# EasyEDA Pro project ADC.eprj

# Schematic Schematic1
Create Date: 2023-12-13; Page Name: P1; Project Name: ADC; Schematic Name: Schematic1; Update Date: 2024-01-19; Company: 嘉立创EDA; Page Size: A4; Version: V1.0
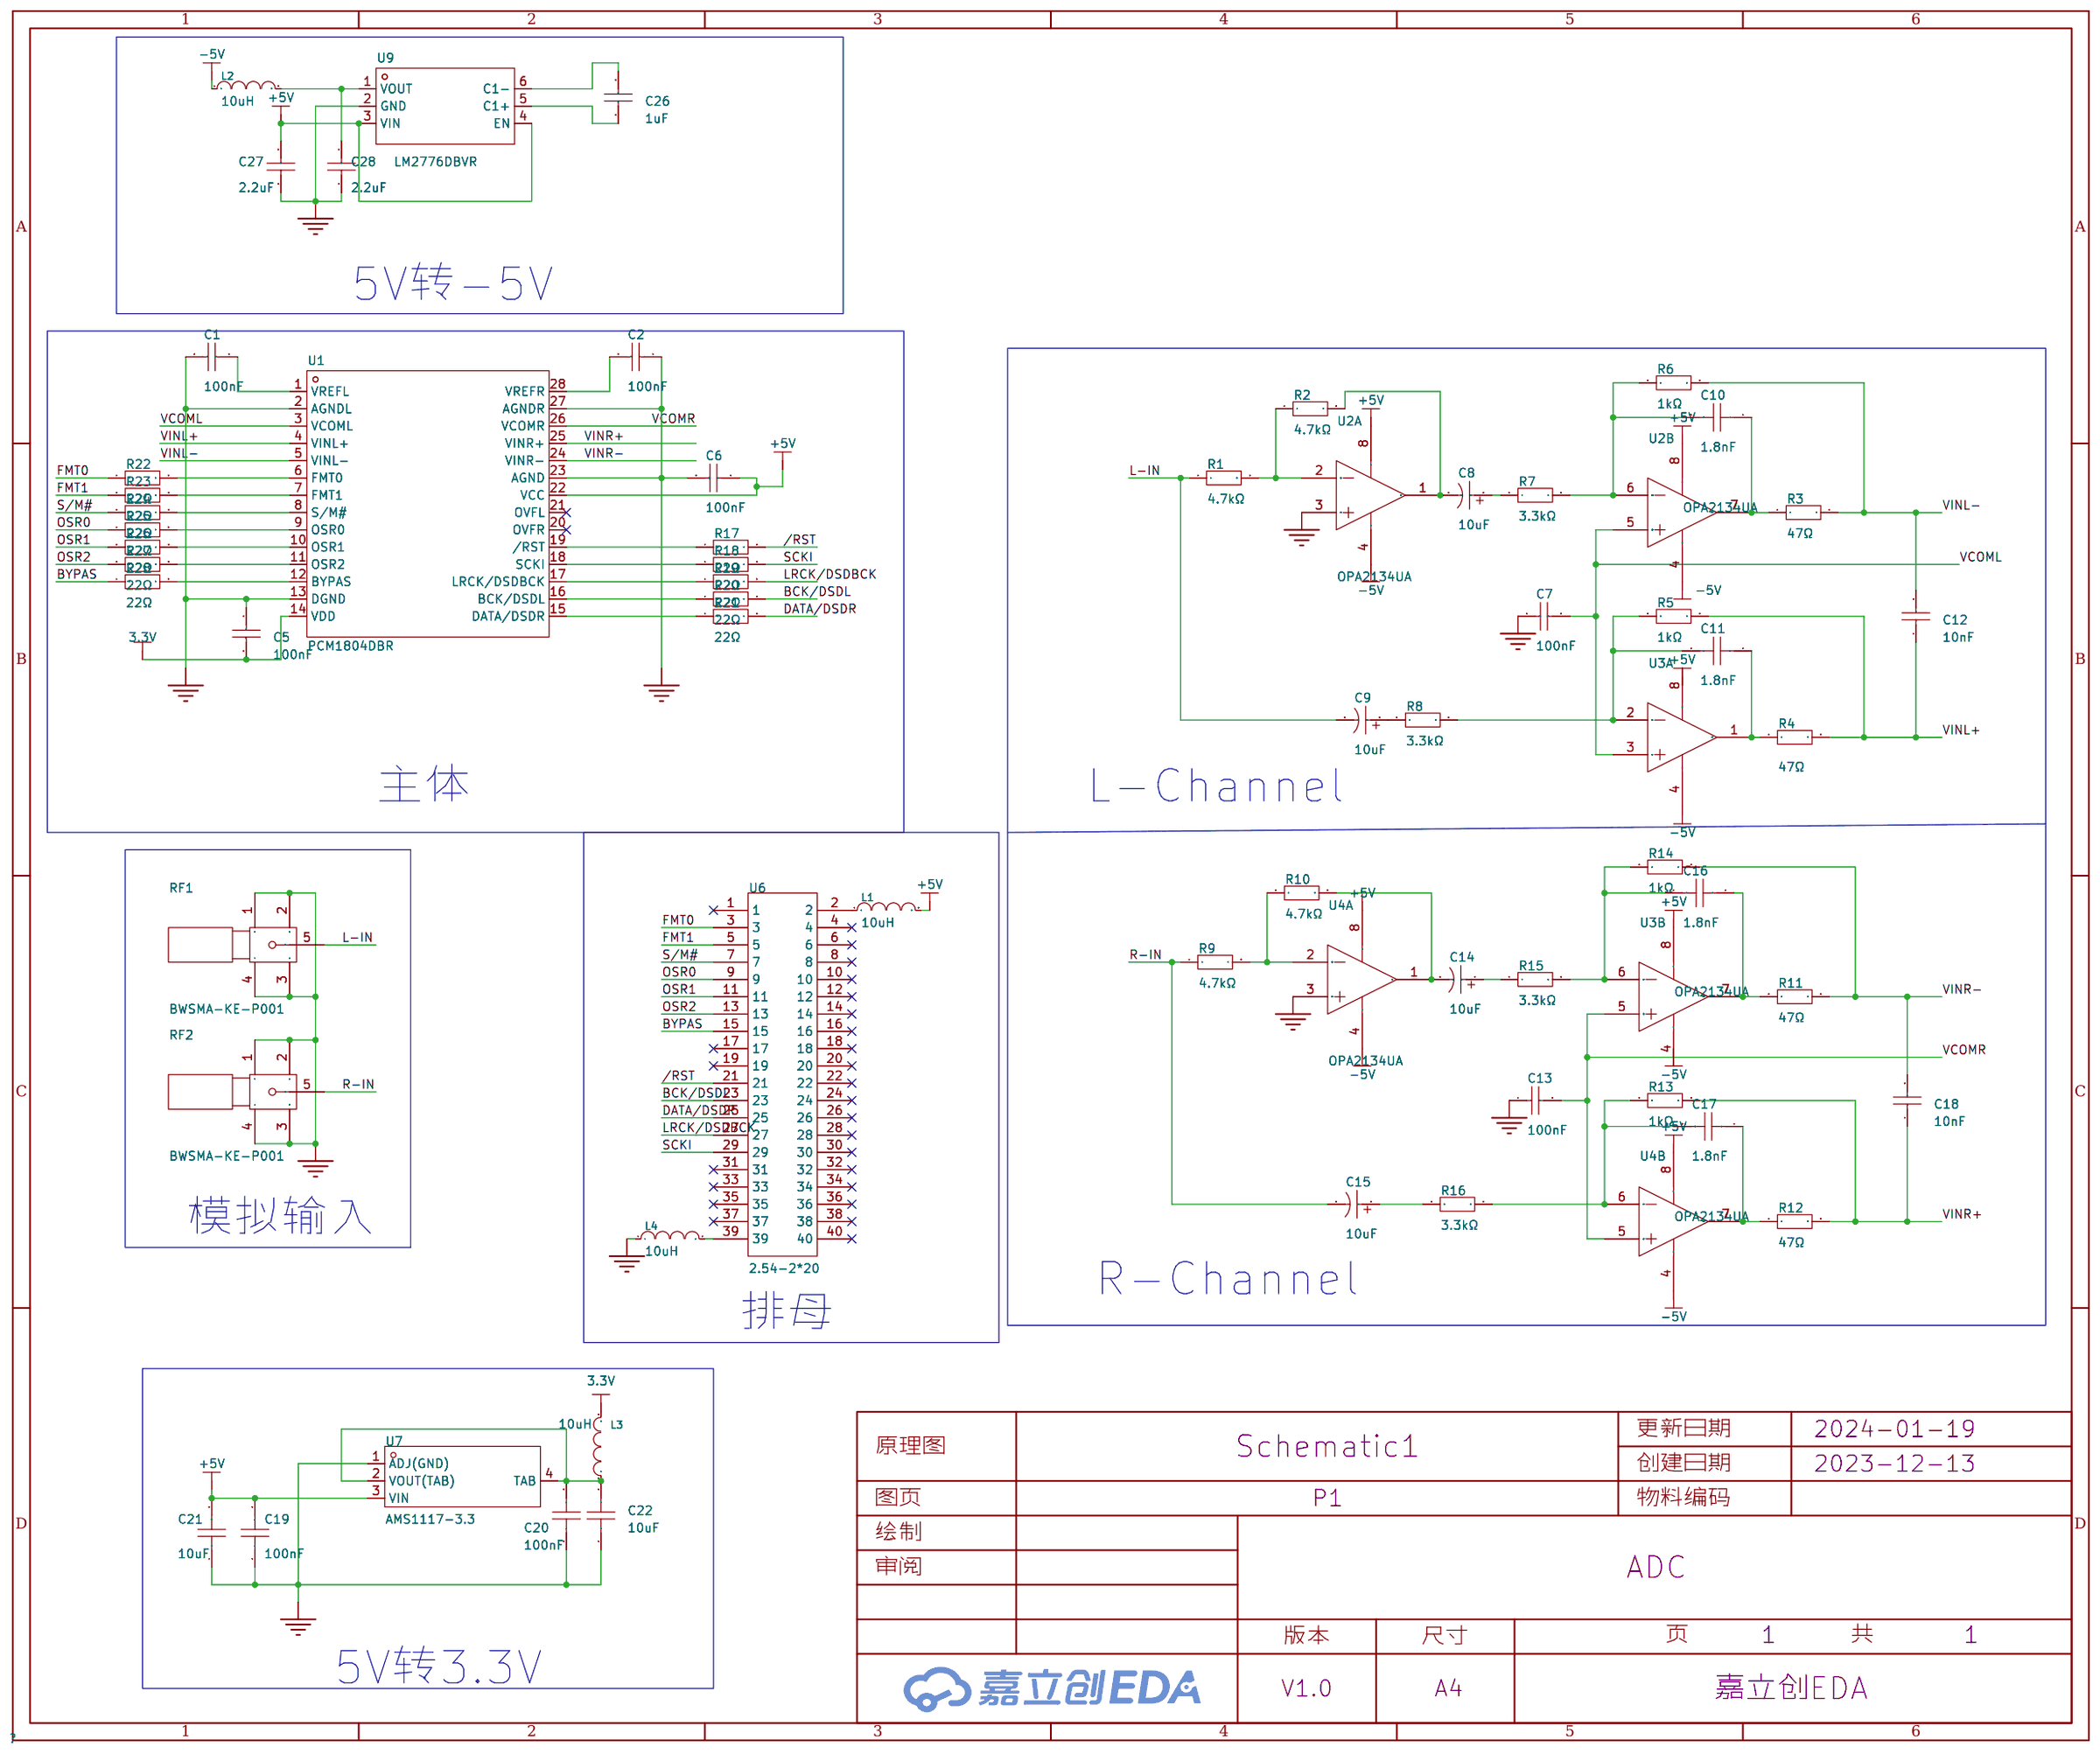
[diagram p0: schematic sheet]

## Parts
C1  100nF  [C0805]
C2  100nF  [C0805]
C5  100nF  [C0805]
C6  100nF  [C0805]
C7  100nF  [C0805]
C8  10uF  [CAP-SMD_BD6.3-L6.6-W6.6-FD]
C9  10uF  [CAP-SMD_BD6.3-L6.6-W6.6-FD]
C10  1.8nF  [C0805]
C11  1.8nF  [C0805]
C12  10nF  [C0805]
C13  100nF  [C0805]
C14  10uF  [CAP-SMD_BD6.3-L6.6-W6.6-FD]
C15  10uF  [CAP-SMD_BD6.3-L6.6-W6.6-FD]
C16  1.8nF  [C0805]
C17  1.8nF  [C0805]
C18  10nF  [C0805]
C19  100nF  [C0805]
C20  100nF  [C0805]
C21  10uF  [C0805]
C22  10uF  [C0805]
C26  1uF  [C0805]
C27  2.2uF  [C0805]
C28  2.2uF  [C0805]
L1  10uH  [L0805]
L2  10uH  [L0805]
L3  10uH  [L0805]
L4  10uH  [L0805]
R1  4.7kΩ  [R0805]
R2  4.7kΩ  [R0805]
R3  47Ω  [R0805]
R4  47Ω  [R0805]
R5  1kΩ  [R0805]
R6  1kΩ  [R0805]
R7  3.3kΩ  [R0805]
R8  3.3kΩ  [R0805]
R9  4.7kΩ  [R0805]
R10  4.7kΩ  [R0805]
R11  47Ω  [R0805]
R12  47Ω  [R0805]
R13  1kΩ  [R0805]
R14  1kΩ  [R0805]
R15  3.3kΩ  [R0805]
R16  3.3kΩ  [R0805]
R17  22Ω  [R0805]
R18  22Ω  [R0805]
R19  22Ω  [R0805]
R20  22Ω  [R0805]
R21  22Ω  [R0805]
R22  22Ω  [R0805]
R23  22Ω  [R0805]
R24  22Ω  [R0805]
R25  22Ω  [R0805]
R26  22Ω  [R0805]
R27  22Ω  [R0805]
R28  22Ω  [R0805]
RF1  BWSMA-KE-P001  [SMA-SMD_BWSMA-KE-P001]
RF2  BWSMA-KE-P001  [SMA-SMD_BWSMA-KE-P001]
U1  PCM1804DBR  [SSOP-28_L10.2-W5.3-P0.65-LS7.8-BL]
U2  OPA2134UA  [SOIC-8_L4.9-W3.9-P1.27-LS6.0-BL]  (sections 1,2)
U3  OPA2134UA  [SOIC-8_L4.9-W3.9-P1.27-LS6.0-BL]  (sections 1,2)
U4  OPA2134UA  [SOIC-8_L4.9-W3.9-P1.27-LS6.0-BL]  (sections 1,2)
U6  2.54-2*20  [HDR-TH_40P-P2.54-V-F-R2-C20-S2.54]
U7  AMS1117-3.3  [SOT-223-4_L6.5-W3.5-P2.30-LS7.0-BR]
U9  LM2776DBVR  [SOT-23-6_L2.9-W1.6-P0.95-LS2.8-BR]

## Library data of the parts
C1 C2 C5-C7 C13 C19 C20 = CC0805KRX7R9BB104: 容值:100nF;精度:±10%;额定电压:50V;材质(温度系数):X7R;; LCSC Part Name: 100nF ±10% 50V; Supplier Part: C49678; Manufacturer: YAGEO(国巨); Supplier Footprint: 0805; JLCPCB Part Class: Basic Part; Datasheet: https://atta.szlcsc.com/upload/public/pdf/source/20180224/C181747_15194369449651363981.pdf; Supplier: LCSC; Tolerance: ±10%; Voltage Rated: 50V; Temperature Coefficient: X7R
C8 C9 C14 C15 = RVT2A100M0607_C72482: 容值:10uF;精度:±20%;额定电压:100V;纹波电流:38mA@120Hz;等效串联电阻:-;; LCSC Part Name: 10uF ±20% 100V; Supplier Part: C72482; Manufacturer: ROQANG(容强); Manufacturer Part: RVT2A100M0607; Supplier Footprint: SMD,D6.3xL7.7mm; JLCPCB Part Class: 扩展库; Datasheet: https://atta.szlcsc.com/upload/public/pdf/source/20170325/1490427950282.pdf; Supplier: LCSC; Tolerance: ±20%; Rated Voltage: 100V; Ripple Current: 38mA@120Hz; φD: 6.3mm; L: 7.7mm; Lifetime @ Temp: 2000hrs@105℃; Operating Temperature: -40℃~+105℃
C10 C11 C16 C17 = CC0805JRNPO9BN182: 容值:1.8nF;精度:±5%;额定电压:50V;材质(温度系数):NP0;; LCSC Part Name: 1.8nF ±5% 50V; Supplier Part: C541499; Manufacturer: YAGEO(国巨); Supplier Footprint: 0805; JLCPCB Part Class: Extended Part; Datasheet: https://atta.szlcsc.com/upload/public/pdf/source/20200615/C541499_C350122DC0EF514A427E90C64CBF9163.pdf; Supplier: LCSC; Tolerance: ±5%; Voltage Rated: 50V; Temperature Coefficient: NP0
C12 C18 = CL21B103KBANNNC: 容值:10nF;精度:±10%;额定电压:50V;材质(温度系数):X7R;; LCSC Part Name: 10nF ±10% 50V; Supplier Part: C1710; Manufacturer: SAMSUNG(三星); Supplier Footprint: 0805; JLCPCB Part Class: Basic Part; Datasheet: https://atta.szlcsc.com/upload/public/pdf/source/20160218/1457707763339.pdf; Supplier: LCSC; Tolerance: ±10%; Voltage Rated: 50V; Temperature Coefficient: X7R
C21 C22 = CL21A106KAYNNNE_C15850: 容值:10uF;精度:±10%;额定电压:25V;材质(温度系数):X5R;; LCSC Part Name: 10uF ±10% 25V; Supplier Part: C15850; Manufacturer: SAMSUNG(三星); Manufacturer Part: CL21A106KAYNNNE; Supplier Footprint: 0805; JLCPCB Part Class: Basic Part; Datasheet: https://atta.szlcsc.com/upload/public/pdf/source/20160103/1457707679302.pdf; Supplier: LCSC; Tolerance: ±10%; Voltage Rated: 25V; Temperature Coefficient: X5R
C26 = CL21B105KBFNNNE: 容值:1uF;精度:±10%;额定电压:50V;材质(温度系数):X7R;; LCSC Part Name: 1uF ±10% 50V; Supplier Part: C28323; Manufacturer: SAMSUNG(三星); Supplier Footprint: 0805; JLCPCB Part Class: Basic Part; Datasheet: https://atta.szlcsc.com/upload/public/pdf/source/20160218/1457707763339.pdf; Supplier: LCSC; Tolerance: ±10%; Voltage Rated: 50V; Temperature Coefficient: X7R
C27 C28 = CL21A225KBQNNNE: 容值:2.2uF;精度:±10%;额定电压:50V;材质(温度系数):X5R;; LCSC Part Name: 2.2uF ±10% 50V; Supplier Part: C377773; Manufacturer: SAMSUNG(三星); Supplier Footprint: 0805; JLCPCB Part Class: Extended Part; Datasheet: https://atta.szlcsc.com/upload/public/pdf/source/20190327/C377773_F663556E8B678C5EA7A210E6B154453B.pdf; Supplier: LCSC; Tolerance: ±10%; Voltage Rated: 50V; Temperature Coefficient: X5R
L1-L4 = SDFL2012S100KTF: 电感值:10uH;精度:±10%;额定电流:15mA;饱和电流(Isat):-;直流电阻(DCR):1.15Ω;; LCSC Part Name: 10uH ±10%; Supplier Part: C1046; Manufacturer: Sunlord(顺络); Supplier Footprint: 0805; JLCPCB Part Class: Basic Part; Datasheet: https://atta.szlcsc.com/upload/public/pdf/source/20210816/855F4348312D259031B87CBCF31BE802.pdf; Supplier: LCSC; Tolerance: ±10%; Rated Current: 15mA; DC Resistance (DCR): 1.15Ω
R1 R2 R9 R10 = 0805W8F4701T5E: 阻值:4.7kΩ;精度:±1%;功率:125mW;温度系数:±100ppm/℃;电阻类型:厚膜电阻;; LCSC Part Name: 4.7kΩ ±1% 125mW 厚膜电阻; Supplier Part: C17673; Manufacturer: UNI-ROYAL(厚声); Supplier Footprint: 0805; JLCPCB Part Class: Basic Part; Datasheet: https://atta.szlcsc.com/upload/public/pdf/source/20200306/C422600_1E6D84923E4A46A82E41ADD87F860B5C.pdf; Supplier: LCSC; Tolerance: ±1%; Power(Watts): 125mW; Overload Voltage (Max): 150V; Temperature Coefficient: ±100ppm/℃; Type: 厚膜电阻; Operating Temperature Range: -55℃~+155℃
R3 R4 R11 R12 = 0805W8F4702T5E: 阻值:47kΩ;精度:±1%;功率:125mW;温度系数:±100ppm/℃;电阻类型:厚膜电阻;; LCSC Part Name: 47kΩ ±1% 125mW 厚膜电阻; Supplier Part: C17713; Manufacturer: UNI-ROYAL(厚声); Supplier Footprint: 0805; JLCPCB Part Class: Basic Part; Datasheet: https://atta.szlcsc.com/upload/public/pdf/source/20200306/C422600_1E6D84923E4A46A82E41ADD87F860B5C.pdf; Supplier: LCSC; Tolerance: ±1%; Power(Watts): 125mW; Overload Voltage (Max): 150V; Temperature Coefficient: ±100ppm/℃; Type: 厚膜电阻; Operating Temperature Range: -55℃~+155℃
R5 R6 R13 R14 = 0805W8F1001T5E: 阻值:1kΩ;精度:±1%;功率:125mW;温度系数:±100ppm/℃;电阻类型:厚膜电阻;; LCSC Part Name: 1kΩ ±1% 125mW 厚膜电阻; Supplier Part: C17513; Manufacturer: UNI-ROYAL(厚声); Supplier Footprint: 0805; JLCPCB Part Class: Basic Part; Datasheet: https://atta.szlcsc.com/upload/public/pdf/source/20200306/C422600_1E6D84923E4A46A82E41ADD87F860B5C.pdf; Supplier: LCSC; Tolerance: ±1%; Power(Watts): 125mW; Overload Voltage (Max): 150V; Temperature Coefficient: ±100ppm/℃; Type: 厚膜电阻; Operating Temperature Range: -55℃~+155℃
R7 R8 R15 R16 = 0805W8F3301T5E: 阻值:3.3kΩ;精度:±1%;功率:125mW;温度系数:±100ppm/℃;电阻类型:厚膜电阻;; LCSC Part Name: 3.3kΩ ±1% 125mW 厚膜电阻; Supplier Part: C26010; Manufacturer: UNI-ROYAL(厚声); Supplier Footprint: 0805; JLCPCB Part Class: Basic Part; Datasheet: https://atta.szlcsc.com/upload/public/pdf/source/20200306/C422600_1E6D84923E4A46A82E41ADD87F860B5C.pdf; Supplier: LCSC; Tolerance: ±1%; Power(Watts): 125mW; Overload Voltage (Max): 150V; Temperature Coefficient: ±100ppm/℃; Type: 厚膜电阻; Operating Temperature Range: -55℃~+155℃
R17-R28 = 0805W8F220JT5E: 阻值:22Ω;精度:±1%;功率:125mW;温度系数:±100ppm/℃;电阻类型:厚膜电阻;; LCSC Part Name: 22Ω ±1% 125mW 厚膜电阻; Supplier Part: C17561; Manufacturer: UNI-ROYAL(厚声); Supplier Footprint: 0805; JLCPCB Part Class: 基础库; Datasheet: https://atta.szlcsc.com/upload/public/pdf/source/20200306/C422600_1E6D84923E4A46A82E41ADD87F860B5C.pdf; Supplier: LCSC; Tolerance: ±1%; Power(Watts): 125mW; Overload Voltage (Max): 150V; Temperature Coefficient: ±100ppm/℃; Type: 厚膜电阻; Operating Temperature Range: -55℃~+155℃
RF1 RF2 = BWSMA-KE-P001: 连接器类型:板端;接口类型:内孔;端口数量:1;接口直径:5.2mm;接口长度/高度:-;频率-最大值:-;射频系列:SMA;阻抗:50Ω;样式:偏脚;触头材质:-;触头镀层:-;工作温度范围:-;焊接温度(最大值):-;; LCSC Part Name: 内孔 SMA 偏脚 SMA偏脚板端座子; Supplier Part: C496550; Manufacturer: BAT WIRELESS(蝙蝠无线); Supplier Footprint: 插件; JLCPCB Part Class: Extended Part; Datasheet: https://atta.szlcsc.com/upload/public/pdf/source/20200416/C496550_06668BF2E3B968EA39F96D17E7156373.pdf; Supplier: LCSC; Connector Type: 板端; Interface Type: 内孔; Number of Ports: 1; Interface Diameter: 5.2mm; RF Series: SMA; Impedance: 50Ω; Style: 偏脚
U1 = PCM1804DBR: 供电电压:3V~3.6V；4.75V~5.25V;分辨率(位):24;接口类型:I2S;; Supplier Part: C62360; Manufacturer: TI(德州仪器); Supplier Footprint: SSOP-28-208mil; JLCPCB Part Class: 扩展库; Datasheet: https://www.ti.com/cn/lit/gpn/pcm1804; Supplier: LCSC; Supply Voltage: 3V~3.6V；4.75V~5.25V; Number of Channels: 2; Resolution: 24; Interface Type: I2S; Operating Temperature: -10℃~+70℃
U2-U4 = OPA2134UA: 功放类型:-;扬声器通道数:2通道;输出功率:-;; Supplier Part: C2860321; Manufacturer: TI(德州仪器); Supplier Footprint: SOIC-8; JLCPCB Part Class: Extended Part; Datasheet: https://atta.szlcsc.com/upload/public/pdf/source/20230221/04F5AACAA47A202A62C17BFD20F1D2D5.pdf; Supplier: LCSC; Speaker Channels: 2通道; Operating Temperature: -40℃~+85℃
U6 = 2.54-2*20: 排数:双排;总孔位数:40P;间距:2.54mm;插孔结构:2x20P;行距:2.54mm;安装类型:直插;圆孔/方孔:方孔;额定电流:2.5A;额定电压:-;插孔方向:顶部;塑高:8.5mm;工作温度范围:-40℃~+105℃;; LCSC Part Name: 间距:2.54mm 2x20P 直插 镀金环保阻燃UL认证; Supplier Part: C2977589; Manufacturer: ZHOURI(洲日); Supplier Footprint: 插件,P=2.54mm; JLCPCB Part Class: 扩展库; Datasheet: https://atta.szlcsc.com/upload/public/pdf/source/20220328/834E302BE3C038BBC5C70F5E02589B1E.pdf; Supplier: LCSC; Number of Rows: 双排; Number of Holes: 40P; Pitch: 2.54mm; Holes Structure: 2x20P; Row Spacing: 2.54mm; Mounting Type: 直插; Circular Hole / Square Hole: 方孔; Current Rating (Max): 2.5A; Holes Direction: 顶部; Insulation Height: 8.5mm; Operating Temperature Range: -40℃~+105℃
U7 = AMS1117-3.3_C347222: 输出类型:固定;最大输入电压:18V;输出电压:3.3V;输出电流:1A;电源纹波抑制比(PSRR):60dB@(120Hz);输出极性:正;; LCSC Part Name: 输入18V 输出3.3V 1A; Supplier Part: C347222; Manufacturer: UMW(友台半导体); Supplier Footprint: SOT-223; JLCPCB Part Class: 扩展库; Datasheet: https://atta.szlcsc.com/upload/public/pdf/source/20231109/155D79A26D9DB04352555A58D5969DC8.pdf; Supplier: LCSC; Output Type: 固定; Maximum Input Voltage: 18V; Output Voltage: 3.3V; Output Current: 1A; Power Supply Rejection Ratio (PSRR): 60dB@(120Hz); Dropout Voltage: 1.3V@(1A); Output Polarity: 正; Number of Outputs: 1
U9 = LM2776DBVR: 功能类型:电荷泵;输出类型:固定;输入电压:2.7V~5.5V;输出电压:-5.5V~-2.7V;输出电流(最大值):200mA;; Supplier Part: C69527; Manufacturer: TI(德州仪器); Supplier Footprint: SOT-23-6; JLCPCB Part Class: 扩展库; Datasheet: https://www.ti.com/cn/lit/gpn/lm2776; Supplier: LCSC; Function: 电荷泵; Synchronous Rectification: 否; Output Type: 固定; Number of Outputs: 1; Input Voltage: 2.7V~5.5V; Output Voltage: -5.5V~-2.7V; Output Current (Max): 200mA; Switching Frequency: 2MHz; Operating Temperature: -40℃~+85℃@(TA)

## Nets
3.3V: C5.2 L3.2 U1.14(VDD)
+5V: C6.1 C19.2 C21.2 C27.2 L1.2 U1.22(VCC) U2.8(V+) U3.8(V+) U4.8(V+) U7.3(VIN) U9.3(VIN) U9.4(EN)
-5V: L2.1 U2.4(V-) U3.4(V-) U4.4(V-)
GND: C1.2 C2.1 C5.1 C6.2 C7.1 C13.1 C19.1 C20.1 C21.1 C22.1 C27.1 C28.1 L4.1 RF1.1 RF1.2 RF1.3 RF1.4 RF2.1 RF2.2 RF2.3 RF2.4 U1.2(AGNDL) U1.13(DGND) U1.23(AGND) U1.27(AGNDR) U2.3(+IN A) U4.3(+IN A) U7.1(ADJ(GND)) U9.2(GND)
VINL+: C12.1 R4.2 R5.2 U1.4(VINL+)
VINL-: C12.2 R3.2 R6.2 U1.5(VINL-)
VINR+: C18.1 R12.2 R13.2 U1.25(VINR+)
VINR-: C18.2 R11.2 R14.2 U1.24(VINR-)
/RST: R17.2 U6.21
BCK/DSDL: R20.2 U6.23
BYPAS: R28.1 U6.15
DATA/DSDR: R21.2 U6.25
FMT0: R22.1 U6.3
FMT1: R23.1 U6.5
L-IN: C9.2 R1.1 RF1.5
LRCK/DSDBCK: R19.2 U6.27
OSR0: R25.1 U6.9
OSR1: R26.1 U6.11
OSR2: R27.1 U6.13
R-IN: C15.2 R9.1 RF2.5
S/M#: R24.1 U6.7
SCKI: R18.2 U6.29
VCOML: C7.2 U1.3(VCOML) U2.5(+IN B) U3.3(+IN A)
VCOMR: C13.2 U1.26(VCOMR) U3.5(+IN B) U4.5(+IN B)
$1N963: R22.2 U1.6(FMT0)
$1N966: R23.2 U1.7(FMT1)
$1N969: R24.2 U1.8(S/M#)
$1N972: R25.2 U1.9(OSR0)
$1N975: R26.2 U1.10(OSR1)
$1N978: R27.2 U1.11(OSR2)
$1N981: R28.2 U1.12(BYPAS)
$1N984: R21.1 U1.15(DATA/DSDR)
$1N987: R20.1 U1.16(BCK/DSDL)
$1N990: R19.1 U1.17(LRCK/DSDBCK)
$1N993: R18.1 U1.18(SCKI)
$1N996: R17.1 U1.19(/RST)
$1N1209: C1.1 U1.1(VREFL)
$1N1256: C2.2 U1.28(VREFR)
$1N1970: R1.2 R2.1 U2.2(-IN A)
$1N1981: C8.2 R2.2 U2.1(OUT A)
$1N3561: C8.1 R7.1
$1N3720: C9.1 R8.1
$1N3842: C10.2 R6.1 R7.2 U2.6(-IN B)
$1N3853: C10.1 R3.1 U2.7(OUT B)
$1N3857: C11.1 R4.1 U3.1(OUT A)
$1N3861: C11.2 R5.1 R8.2 U3.2(-IN A)
$1N4676: R9.2 R10.1 U4.2(-IN A)
$1N4677: C14.2 R10.2 U4.1(OUT A)
$1N4681: C14.1 R15.1
$1N4683: C15.1 R16.1
$1N4688: C16.2 R14.1 R15.2 U3.6(-IN B)
$1N4694: C16.1 R11.1 U3.7(OUT B)
$1N4697: C17.1 R12.1 U4.7(OUT B)
$1N4700: C17.2 R13.1 R16.2 U4.6(-IN B)
$1N6196: C20.2 C22.2 L3.1 U7.2(VOUT(TAB)) U7.4(TAB)
$1N15402: L1.1 U6.2
$1N31086: C26.2 U9.6(C1-)
$1N31091: C26.1 U9.5(C1+)
$1N34155: C28.2 L2.2 U9.1(VOUT)
$1N35743: L4.2 U6.39

Not connected (* = marked no-connect by the designer): U1 20(OVFR)* 21(OVFL)*; U6 1* 4* 6* 8* 10* 12* 14* 16* 17* 18* 19* 20* 22* 24* 26* 28* 30* 31* 32* 33* 34* 35* 36* 37* 38* 40*

## Notes on the sheet
- 5V转-5V
- 主体
- L-Channel
- 模拟输入
- R-Channel
- 排母
- 5V转3.3V

# Board PCB1
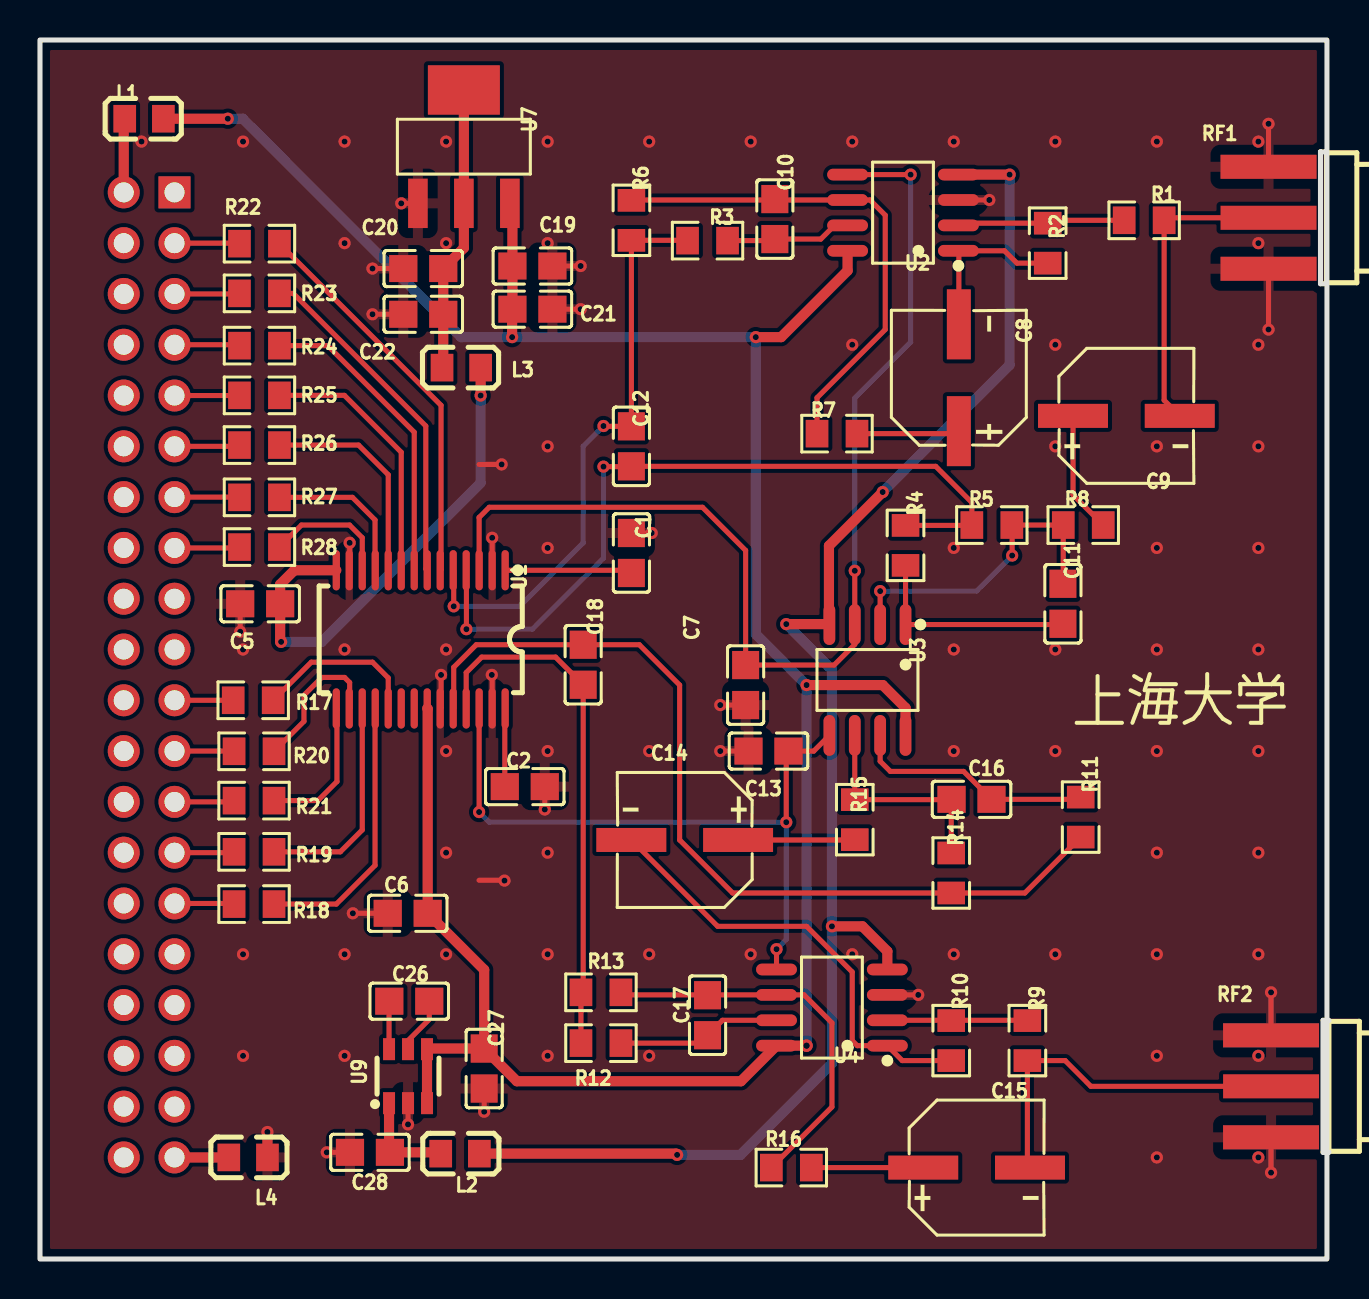
[diagram p1: board, top side]
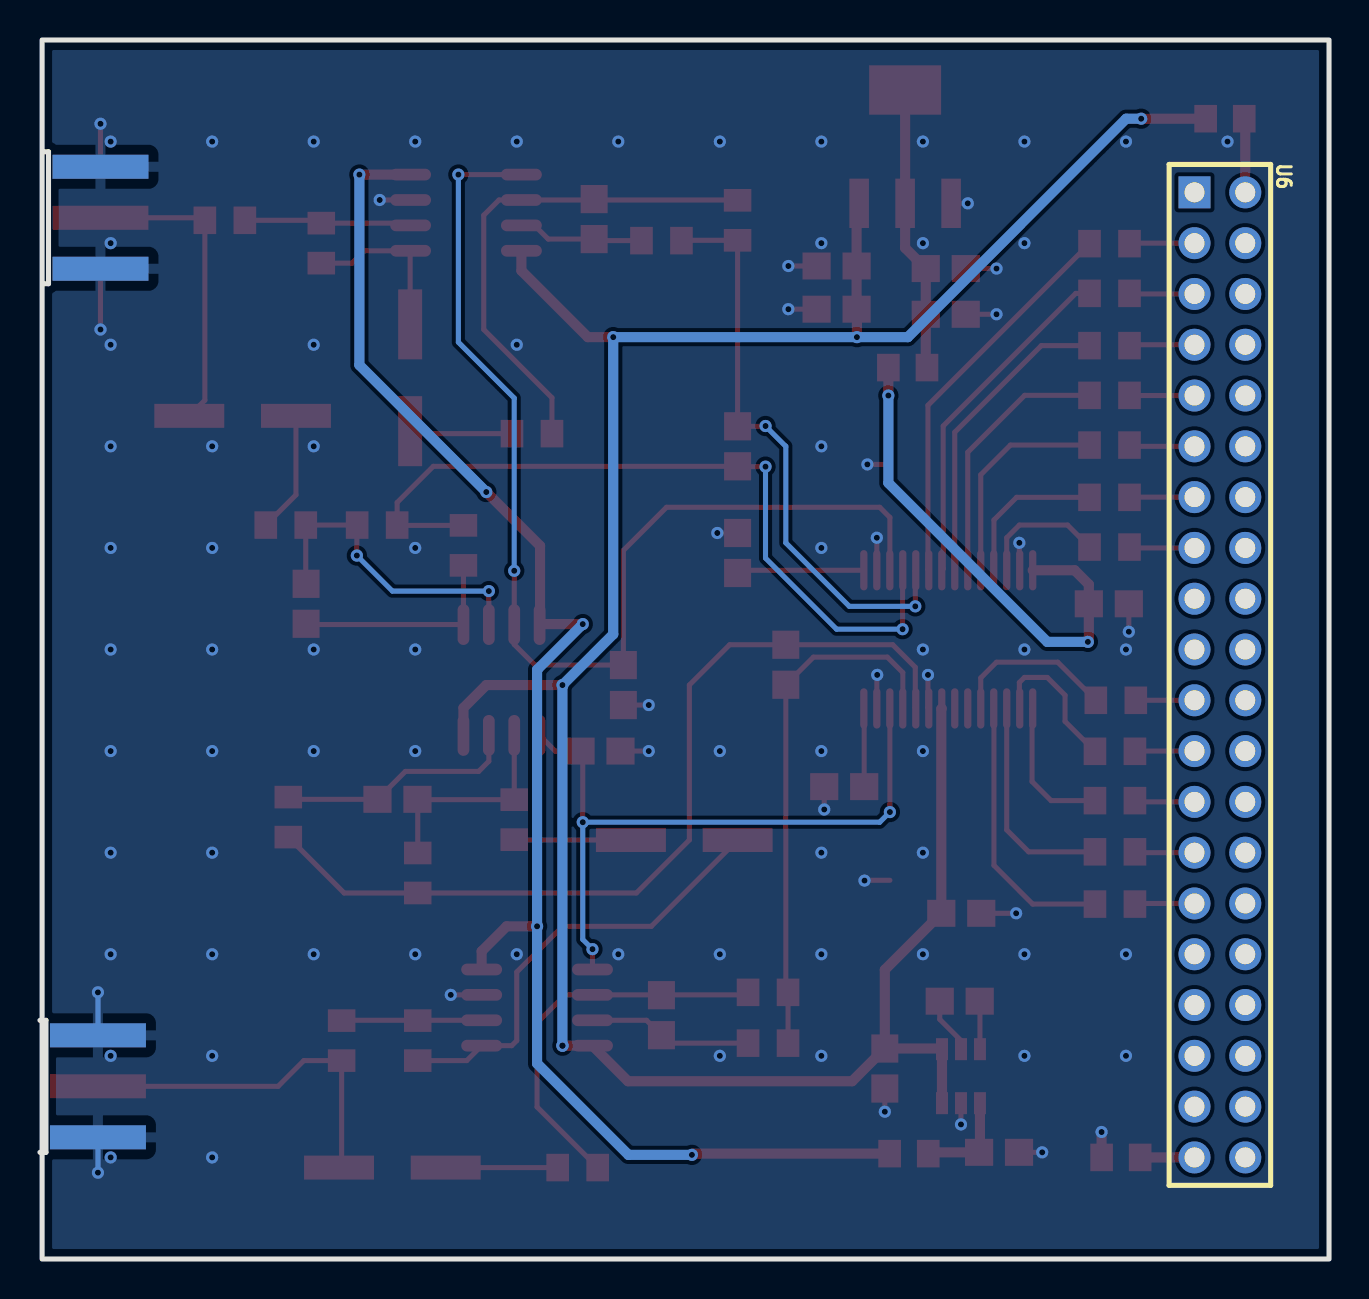
[diagram p2: board, bottom side, seen from below]

Outline 64.5 x 60.96 mm; copper layers: Top Layer, Bottom Layer. Coordinates in mm from the lower left corner of the outline.
Outline path: rectangle 0,60.96 64.39,0
Stack: Top Layer 0.035mm - / Dielectric1 1.51mm FR4 er 4.5 / Bottom Layer 0.035mm -

## Design rules (mm)
template: 自定义配置
spacing copperThickness1oz (default): track to track 0.102, other pairs 0.102 to 0.3
spacing copperThickness2oz: track to track 0.203, other pairs 0.152 to 0.3
track width copperThickness1oz (default): min 0.127, default 0.254, max 2.54
track width copperThickness2oz: min 0.203, default 0.254, max 2.54
differential pair differentialPair (default): width min 0.127, default 0.254, max 2.54; gap min 0.152, default 0.152
via viaSize (default): diameter min 0.5, default 0.61, max 10; hole min 0.3, default 0.305, max 6.299

## Placement (name value [footprint] x y rotation side)
C1  100nF  [C0805]  29.59 35.31 90 top
C2  100nF  [C0805]  24.26 23.62 180 top
C5  100nF  [C0805]  11.02 32.77 0 top
C6  100nF  [C0805]  18.4 17.29 180 top
C7  100nF  [C0805]  35.31 28.7 90 top
C8  10uF  [CAP-SMD_BD6.3-L6.6-W6.6-FD]  45.97 44.07 90 top
C9  10uF  [CAP-SMD_BD6.3-L6.6-W6.6-FD]  54.36 42.16 0 top
C10  1.8nF  [C0805]  36.77 52.01 90 top
C11  1.8nF  [C0805]  51.18 32.77 90 top
C12  10nF  [C0805]  29.59 40.64 90 top
C13  100nF  [C0805]  36.45 25.4 0 top
C14  10uF  [CAP-SMD_BD6.3-L6.6-W6.6-FD]  32.26 20.96 180 top
C15  10uF  [CAP-SMD_BD6.3-L6.6-W6.6-FD]  46.86 4.57 0 top
C16  1.8nF  [C0805]  46.61 22.99 180 top
C17  1.8nF  [C0805]  33.4 12.19 90 top
C18  10nF  [C0805]  27.18 29.72 90 top
C19  100nF  [C0805]  24.64 49.66 180 top
C20  100nF  [C0805]  19.18 49.53 0 top
C21  10uF  [C0805]  24.64 47.5 180 top
C22  10uF  [C0805]  19.18 47.24 0 top
C26  1uF  [C0805]  18.48 12.89 180 top
C27  2.2uF  [C0805]  22.23 9.53 90 top
C28  2.2uF  [C0805]  16.51 5.33 0 top
L1  10uH  [L0805]  5.21 57.02 0 top
L2  10uH  [L0805]  21.02 5.27 180 top
L3  10uH  [L0805]  21.08 44.58 0 top
L4  10uH  [L0805]  10.41 5.08 180 top
R1  4.7kΩ  [R0805]  55.25 51.94 180 top
R2  4.7kΩ  [R0805]  50.42 50.8 270 top
R3  47Ω  [R0805]  33.4 50.93 180 top
R4  47Ω  [R0805]  43.31 35.69 90 top
R5  1kΩ  [R0805]  47.63 36.7 180 top
R6  1kΩ  [R0805]  29.59 51.94 270 top
R7  3.3kΩ  [R0805]  39.88 41.28 180 top
R8  3.3kΩ  [R0805]  52.2 36.7 180 top
R9  4.7kΩ  [R0805]  49.4 10.92 90 top
R10  4.7kΩ  [R0805]  45.59 10.92 270 top
R11  47Ω  [R0805]  52.07 22.1 270 top
R12  47Ω  [R0805]  28.07 10.8 180 top
R13  1kΩ  [R0805]  28.07 13.34 180 top
R14  1kΩ  [R0805]  45.59 19.3 270 top
R15  3.3kΩ  [R0805]  40.77 21.97 90 top
R16  3.3kΩ  [R0805]  37.59 4.57 180 top
R17  22Ω  [R0805]  10.67 27.94 180 top
R18  22Ω  [R0805]  10.71 17.75 180 top
R19  22Ω  [R0805]  10.71 20.36 180 top
R20  22Ω  [R0805]  10.71 25.39 180 top
R21  22Ω  [R0805]  10.71 22.92 180 top
R22  22Ω  [R0805]  10.98 50.78 0 top
R23  22Ω  [R0805]  10.98 48.29 0 top
R24  22Ω  [R0805]  10.98 45.68 0 top
R25  22Ω  [R0805]  10.98 43.19 0 top
R26  22Ω  [R0805]  10.98 40.7 0 top
R27  22Ω  [R0805]  10.98 38.09 0 top
R28  22Ω  [R0805]  10.98 35.6 0 top
RF1  BWSMA-KE-P001  [SMA-SMD_BWSMA-KE-P001]  61.47 52.07 0 top
RF2  BWSMA-KE-P001  [SMA-SMD_BWSMA-KE-P001]  61.6 8.64 0 top
U1  PCM1804DBR  [SSOP-28_L10.2-W5.3-P0.65-LS7.8-BL]  19.05 30.99 180 top
U2  OPA2134UA  [SOIC-8_L4.9-W3.9-P1.27-LS6.0-BL]  43.18 52.32 90 top
U3  OPA2134UA  [SOIC-8_L4.9-W3.9-P1.27-LS6.0-BL]  41.4 28.96 180 top
U4  OPA2134UA  [SOIC-8_L4.9-W3.9-P1.27-LS6.0-BL]  39.62 12.57 90 top
U6  2.54-2*20  [HDR-TH_40P-P2.54-V-F-R2-C20-S2.54]  5.46 29.21 270 bottom
U7  AMS1117-3.3  [SOT-223-4_L6.5-W3.5-P2.30-LS7.0-BR]  21.21 55.63 270 top
U9  LM2776DBVR  [SOT-23-6_L2.9-W1.6-P0.95-LS2.8-BR]  18.42 9.14 270 top

## Footprints (pads in the part's own frame, mm; a bottom-side part is the same pattern mirrored in y, then rotated)
C0805
  rect 1.41x1.35 smd: 1(-1,0) 2(1,0)
CAP-SMD_BD6.3-L6.6-W6.6-FD
  rect 3.5x1.2 smd: 1(-2.67,0) 2(2.67,0)
HDR-TH_40P-P2.54-V-F-R2-C20-S2.54
  rect 1.6x1.6 hole 1: 1(-24.13,-1.27)
  round 1.6 hole 1: 2(-24.13,1.27) 3(-21.59,-1.27) 4(-21.59,1.27) 5(-19.05,-1.27) 6(-19.05,1.27) 7(-16.51,-1.27) 8(-16.51,1.27) 9(-13.97,-1.27) 10(-13.97,1.27) 11(-11.43,-1.27) 12(-11.43,1.27) 13(-8.89,-1.27) 14(-8.89,1.27) 15(-6.35,-1.27) 16(-6.35,1.27) 17(-3.81,-1.27) 18(-3.81,1.27) 19(-1.27,-1.27) 20(-1.27,1.27) 21(1.27,-1.27) 22(1.27,1.27) 23(3.81,-1.27) 24(3.81,1.27) 25(6.35,-1.27) 26(6.35,1.27) 27(8.89,-1.27) 28(8.89,1.27) 29(11.43,-1.27) 30(11.43,1.27) 31(13.97,-1.27) 32(13.97,1.27) 33(16.51,-1.27) 34(16.51,1.27) 35(19.05,-1.27) 36(19.05,1.27) 37(21.59,-1.27) 38(21.59,1.27) 39(24.13,-1.27) 40(24.13,1.27)
L0805
  rect 1.133x1.377 smd: 1(-0.966,0) 2(0.966,0)
R0805
  rect 1.133x1.377 smd: 1(-1,0) 2(1,0)
SMA-SMD_BWSMA-KE-P001
  rect 4.8x1.2 smd: 1(0,-2.55) 2(0,2.55) 5(0,0)
  rect 4.8x1.2 smd far side: 3(0,2.55) 4(0,-2.55)
SOIC-8_L4.9-W3.9-P1.27-LS6.0-BL
  oval 0.588x2.045 smd: 1(-1.905,-2.772) 2(-0.635,-2.772) 3(0.635,-2.772) 4(1.905,-2.772) 5(1.905,2.772) 6(0.635,2.772) 7(-0.635,2.772) 8(-1.905,2.772)
SOT-23-6_L2.9-W1.6-P0.95-LS2.8-BR
  rect 1.1x0.6 smd: 1(1.35,-0.95) 2(1.35,0) 3(1.35,0.95) 4(-1.35,0.95) 5(-1.35,0) 6(-1.35,-0.95)
SOT-223-4_L6.5-W3.5-P2.30-LS7.0-BR
  rect 2.47x0.98 smd: 1(2.835,-2.3) 2(2.835,0) 3(2.835,2.3)
  rect 2.47x3.6 smd: 4(-2.835,0)
SSOP-28_L10.2-W5.3-P0.65-LS7.8-BL
  oval 0.364x2.015 smd: 1(-4.225,-3.455) 2(-3.575,-3.455) 3(-2.925,-3.455) 4(-2.275,-3.455) 5(-1.625,-3.455) 6(-0.975,-3.455) 7(-0.325,-3.455) 8(0.325,-3.455) 9(0.975,-3.455) 10(1.625,-3.455) 11(2.275,-3.455) 12(2.925,-3.455) 13(3.575,-3.455) 14(4.225,-3.455) 15(4.225,3.455) 16(3.575,3.455) 17(2.925,3.455) 18(2.275,3.455) 19(1.625,3.455) 20(0.975,3.455) 21(0.325,3.455) 22(-0.325,3.455) 23(-0.975,3.455) 24(-1.625,3.455) 25(-2.275,3.455) 26(-2.925,3.455) 27(-3.575,3.455) 28(-4.225,3.455)

## Nets
As in the schematic.

Pads without a net: U1 20 21; U6 1 4 6 8 10 12 14 16 17 18 19 20 22 24 26 28 30 31 32 33 34 35 36 37 38 40

## Via types
v1: diameter 0.61, hole 0.305, Top Layer to Bottom Layer, 115 vias

## Routing (per net, layer and track width the routed paths; a pad name or vN(x,y) marks a point on that pad's centre or on a via; arc(x,y) is an arc through that point)
3.3V: length 25
  Top Layer w0.508: U1.14 12.73,34.44 12.02,33.73 C5.2 12.02,30.91 v1(12.07,30.86) ; L3.2 v1(22.05,43.18)
  Bottom Layer w0.508: v1(12.07,30.86) 14.1,30.86 22.05,38.81 v1(22.05,43.18)
+5V: length 132.5
  Top Layer w0.508: C27.2 19.4,10.53 U9.4 U9.3 ; C27.2 22.23,14.46 C6.1 19.4,27.51 19.38,27.53 ; C27.2 23.86,8.89 35.07,8.89 U4.8 v1(38.35,10.67) ; v1(35.81,46.1) 37.08,46.1 40.41,49.42 U2.8 ; 23.51,52.79 23.64,52.66 C19.2 C21.2 23.62,47.48 v1(23.62,46.1) ; U3.8 43.31,27.56 42.16,28.7 v1(38.35,28.7) ; L1.2 v1(9.4,57.02)
  Bottom Layer w0.508: v1(9.4,57.02) 10.15,57.02 21.07,46.1 v1(23.62,46.1) v1(35.81,46.1) 35.81,31.24 v1(38.35,28.7) v1(38.35,10.67)
-5V: length 77.6
  Top Layer w0.508: 39.48,31.75 v1(37.34,31.75) ; 39.48,31.75 U3.4 ; 39.48,31.75 39.48,35.67 v1(42.16,38.35) ; v1(48.51,54.23) U2.4 ; U4.4 42.4,15.39 41.15,16.64 v1(39.62,16.64) ; v1(31.88,5.21) 31.82,5.27 L2.1
  Bottom Layer w0.508: v1(31.88,5.21) 35.05,5.21 39.62,9.78 v1(39.62,16.64) 39.62,29.46 v1(37.34,31.75) ; v1(42.16,38.35) 48.51,44.7 v1(48.51,54.23)
GND: length 44.3
  Top Layer w0.254: v1(22.61,29.21) 22.63,29.19 U1.27 ; 21.97,39.74 v1(23.1,39.74) ; C5.1 v1(10.02,31.37) ; U1.13 15.49,34.46 v1(15.49,35.81) ; 21.97,18.94 23.23,18.94 v1(23.24,18.92) ; RF2.2 v1(61.6,13.34) ; v1(61.47,46.48) RF1.1 ; v1(18.42,6.73) U9.2 ; v1(16.64,47.24) C22.1 ; v1(18.08,52.79) 18.91,52.79 ; U1.23 20.07,27.57 v1(20.07,29.21) ; C6.2 v1(15.65,17.29) ; v1(61.6,4.32) RF2.1 ; U4.3 v1(43.94,13.21) ; C21.1 v1(27.05,47.5) ; C27.1 v1(22.23,7.37) ; C20.1 v1(16.64,49.53) ; U1.2 v1(22.63,36.07) ; v1(27.05,49.66) C19.1 ; RF1.2 v1(61.47,56.77) ; C28.1 v1(14.35,5.33) ; v1(34.04,25.4) C13.1 ; C2.1 v1(25.26,22.48) ; U2.3 v1(47.5,52.96) ; C7.1 v1(34.04,27.7) ; C1.2 v1(30.61,36.31)
  Top Layer w0.508: L4.1 v1(11.38,6.35)
  Bottom Layer w0.254: RF2.1 v1(61.6,4.32) ; RF2.2 v1(61.6,13.34)
  vias: v1(5.08,55.88) v1(10.16,55.88) v1(10.16,30.48) v1(10.16,15.24) v1(10.16,10.16) v1(15.24,55.88) v1(15.24,50.8) v1(15.24,30.48) v1(15.24,15.24) v1(15.24,10.16) v1(20.32,55.88) v1(20.32,50.8) v1(20.32,30.48) v1(20.32,25.4) v1(20.32,20.32) v1(20.32,15.24) v1(25.4,55.88) v1(25.4,50.8) v1(25.4,40.64) v1(25.4,35.56) v1(25.4,25.4) v1(25.4,20.32) v1(25.4,15.24) v1(25.4,10.16) v1(30.48,55.88) v1(30.48,25.4) v1(30.48,15.24) v1(30.48,10.16) v1(35.56,55.88) v1(35.56,15.24) v1(40.64,55.88) v1(40.64,45.72) v1(40.64,15.24) v1(45.72,55.88) v1(45.72,35.56) v1(45.72,30.48) v1(45.72,25.4) v1(45.72,15.24) v1(50.8,55.88) v1(50.8,45.72) v1(50.8,40.64) v1(50.8,30.48) v1(50.8,25.4) v1(50.8,15.24) v1(55.88,55.88) v1(55.88,40.64) v1(55.88,35.56) v1(55.88,30.48) v1(55.88,25.4) v1(55.88,20.32) v1(55.88,15.24) v1(55.88,10.16) v1(55.88,5.08) v1(60.96,55.88) v1(60.96,50.8) v1(60.96,45.72) v1(60.96,40.64) v1(60.96,35.56) v1(60.96,30.48) v1(60.96,25.4) v1(60.96,20.32) v1(60.96,15.24) v1(60.96,10.16) v1(60.96,5.08)
VINL+: length 39.5
  Top Layer w0.254: R4.2 46.61,36.69 R5.2 46.63,37.83 44.82,39.64 C12.1 29.58,39.62 v1(28.19,39.62) ; v1(21.34,31.5) 21.34,34.43 U1.4
  Bottom Layer w0.254: v1(21.34,31.5) 24.64,31.5 28.19,35.05 v1(28.19,39.62)
VINL-: length 29.4
  Top Layer w0.254: v1(28.19,41.66) 28.21,41.64 C12.2 R6.2 32.39,50.94 R3.2 ; U1.5 20.7,34.42 v1(20.7,32.64)
  Bottom Layer w0.254: v1(20.7,32.64) 24,32.64 27.18,35.81 27.18,40.64 v1(28.19,41.66)
VINR+: length 26.5
  Top Layer w0.254: R12.2 R13.2 27.18,13.45 C18.1 25.8,30.1 22.1,30.1 21.33,29.33 U1.25
VINR-: length 44.7
  Top Layer w0.254: U1.24 20.7,27.56 20.7,29.59 21.83,30.72 C18.2 29.99,30.72 32,28.7 32,20.96 34.66,18.3 R14.2 49.28,18.3 R11.2
/RST: length 2.9
  Top Layer w0.254: 6.73,27.94 R17.2
BCK/DSDL: length 3
  Top Layer w0.254: 6.73,25.4 9.7,25.4 R20.2
BYPAS: length 3.3
  Top Layer w0.254: 6.73,35.56 9.94,35.56 R28.1
DATA/DSDR: length 3
  Top Layer w0.254: 6.73,22.86 9.65,22.86 R21.2
FMT0: length 3.3
  Top Layer w0.254: R22.1 9.96,50.8 6.73,50.8
FMT1: length 3.3
  Top Layer w0.254: 6.73,48.26 9.95,48.26 R23.1
L-IN: length 15.4
  Top Layer w0.254: RF1.5 56.37,52.07 R1.1 56.25,42.95 C9.2
LRCK/DSDBCK: length 3
  Top Layer w0.254: 6.73,20.32 9.67,20.32 R19.2
OSR0: length 3.3
  Top Layer w0.254: 6.73,43.18 9.97,43.18 R25.1
OSR1: length 3.3
  Top Layer w0.254: 6.73,40.64 9.92,40.64 R26.1
OSR2: length 3.3
  Top Layer w0.254: 6.73,38.1 9.97,38.1 R27.1
R-IN: length 18.1
  Top Layer w0.254: RF2.5 52.58,8.64 51.29,9.92 R9.1 49.4,4.7 C15.2
S/M#: length 3.3
  Top Layer w0.254: 6.73,45.72 9.94,45.72 R24.1
SCKI: length 3
  Top Layer w0.254: 6.73,17.78 9.68,17.78 R18.2
VCOML: length 56.5
  Top Layer w0.254: v1(43.56,54.23) U2.5 ; v1(40.77,34.42) U3.3 40.77,30.73 39.73,29.7 C7.2 35.31,35.43 33.15,37.59 22.48,37.59 21.97,37.08 21.97,34.45 U1.3
  Bottom Layer w0.254: v1(40.77,34.42) 40.77,43.05 43.56,45.85 v1(43.56,54.23)
VCOMR: length 34.3
  Top Layer w0.254: v1(37.34,21.84) 37.34,25.29 C13.2 38.71,25.4 U3.5 ; U1.26 21.97,27.53 v1(21.97,22.35) ; U4.5 v1(36.85,15.49)
  Bottom Layer w0.254: v1(36.85,15.49) 37.34,15.98 v1(37.34,21.84) 22.48,21.84 v1(21.97,22.35)
$1N963: length 19.7
  Top Layer w0.254: R22.2 20.07,42.69 20.07,34.48 U1.6
$1N966: length 17.3
  Top Layer w0.254: 19.38,34.44 19.3,34.51 19.3,41.66 12.67,48.29 R23.2
$1N969: length 15.4
  Top Layer w0.254: U1.8 18.73,41.35 14.4,45.68 R24.2
$1N972: length 13.2
  Top Layer w0.254: U1.9 18.08,40.35 15.23,43.19 R25.2
$1N975: length 10.8
  Top Layer w0.254: R26.2 15.94,40.7 17.42,39.22 U1.10
$1N978: length 7.8
  Top Layer w0.254: U1.11 16.76,34.45 16.76,36.96 15.63,38.09 R27.2
$1N981: length 6.5
  Top Layer w0.254: U1.12 16.13,36.07 15.49,36.7 13.08,36.7 R28.2
$1N984: length 7.2
  Top Layer w0.254: R21.1 13.91,22.92 14.86,23.88 14.86,27.5 U1.15
$1N987: length 7.5
  Top Layer w0.254: U1.16 15.49,27.55 15.49,28.83 15.24,29.08 14.1,29.08 13.21,28.19 13.21,26.89 R20.1
$1N990: length 10.9
  Top Layer w0.254: U1.17 16.13,21.46 15.03,20.36 R19.1
$1N993: length 13.7
  Top Layer w0.254: R18.1 14.83,17.75 16.76,19.69 16.76,27.52 U1.18
$1N996: length 8.4
  Top Layer w0.254: U1.19 17.42,29.06 16.64,29.85 13.57,29.85 R17.1
$1N1209: length 6.4
  Top Layer w0.254: C1.1 29.45,34.44 U1.1
$1N1256: length 3.9
  Top Layer w0.254: U1.28 23.26,27.52 C2.2
$1N1970: length 8.4
  Top Layer w0.254: U2.2 46.06,51.8 R2.1 50.56,51.94 R1.2
$1N1981: length 8.4
  Top Layer w0.254: R2.2 48.88,49.8 48.26,50.42 U2.1 45.97,50.4 C8.2
$1N3561: length 5.1
  Top Layer w0.254: R7.1 45.85,41.28 C8.1
$1N3720: length 6.1
  Top Layer w0.254: C9.1 51.69,38.21 R8.1
$1N3842: length 25.4
  Top Layer w0.254: 36.81,52.96 C10.2 ; 36.81,52.96 U2.6 41.53,52.96 42.29,52.2 42.29,46.48 38.88,43.07 R7.2 ; 36.81,52.96 29.61,52.96 R6.1
$1N3853: length 6.3
  Top Layer w0.254: U2.7 39.75,51.69 39.07,51.01 C10.1 36.69,50.93 R3.1
$1N3857: length 10.8
  Top Layer w0.254: R4.1 U3.1 51.14,31.73 C11.1
$1N3861: length 16.1
  Top Layer w0.254: C11.2 51.2,33.78 R8.2 R5.1 48.64,36.69 v1(48.64,35.18) ; U3.2 v1(42.04,33.4)
  Bottom Layer w0.254: v1(48.64,35.18) 46.86,33.4 v1(42.04,33.4)
$1N4676: length 7
  Top Layer w0.254: R9.2 49.39,11.94 45.58,11.94 ; 45.58,11.94 R10.1 ; 45.58,11.94 U4.2
$1N4677: length 22.6
  Top Layer w0.254: R10.2 43.14,9.92 U4.1 40.89,10.67 40.64,10.92 40.64,14.35 38.35,16.64 33.91,16.64 C14.2
$1N4681: length 5.8
  Top Layer w0.254: R15.1 40.75,20.96 C14.1
$1N4683: length 5.6
  Top Layer w0.254: 44.19,4.57 R16.1
$1N4688: length 10.7
  Top Layer w0.254: 45.59,22.97 C16.2 ; 45.59,22.97 R14.1 ; 45.59,22.97 R15.2 U3.6
$1N4694: length 12.2
  Top Layer w0.254: R11.1 51.96,22.99 C16.1 46.21,24.38 42.55,24.38 42.04,24.89 U3.7
$1N4697: length 8.3
  Top Layer w0.254: R12.1 33,10.8 C17.1 34.15,11.94 U4.7
$1N4700: length 19.7
  Top Layer w0.254: 33.42,13.21 29.19,13.21 R13.1 ; 33.42,13.21 C17.2 ; 33.42,13.21 U4.6 38.23,13.21 39.62,11.81 39.62,7.6 R16.2
$1N6196: length 14.3
  Top Layer w0.508: L3.1 20.18,44.64 C22.2 C20.2 21.21,50.56 U7.4
$1N15402: length 3.7
  Top Layer w0.508: 4.24,57.02 4.19,56.97 U6.2
$1N31086: length 2.4
  Top Layer w0.254: C26.2 17.47,12.88 U9.6
$1N31091: length 2.8
  Top Layer w0.254: C26.1 19.48,11.98 18.42,10.92 U9.5
$1N34155: length 5
  Top Layer w0.508: U9.1 17.47,5.38 C28.2 19.99,5.33 L2.2
$1N35743: length 2.7
  Top Layer w0.508: 6.73,5.08 L4.2

## Copper pours and planes (outline as drawn; the poured copper is in the pictures)
GND on Top Layer: 0,60.96 64.39,60.96 64.39,0 0,0
GND on Bottom Layer: 0,60.96 64.39,60.96 64.39,0 0,0

## Text on the board
Top Silkscreen Layer: 上海大学
